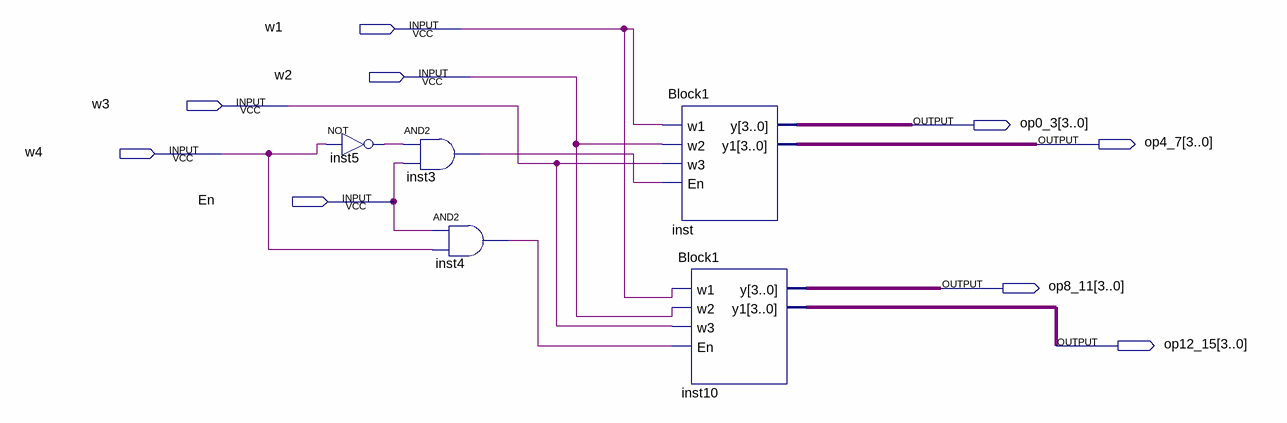
[diagram p0: schematic sheet]
// Quartus schematic test.bdf as structural Verilog: 5 symbols, 9 pins
module test (
  input  w1,
  input  w2,
  input  w3,
  input  w4,
  input  En,
  output [3:0] op0_3,
  output [3:0] op4_7,
  output [3:0] op8_11,
  output [3:0] op12_15
);

  wire inst3_out, inst4_out, inst5_out;

  not inst5 (inst5_out, w4);
  and inst3 (inst3_out, inst5_out, En);
  and inst4 (inst4_out, En, w4);
  Block1 inst (.w1(w1), .w2(w2), .w3(w3), .En(inst3_out), .y(op0_3), .y1(op4_7));
  Block1 inst10 (.w1(w1), .w2(w2), .w3(w3), .En(inst4_out), .y(op8_11), .y1(op12_15));
endmodule
